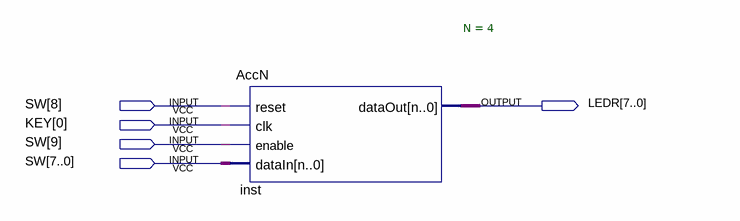
[diagram p0: schematic sheet]
// Quartus schematic AccN_Demo.bdf as structural Verilog: 1 symbols, 5 pins
module AccN_Demo (
  input  [9:0] SW,
  input  [0:0] KEY,
  output [7:0] LEDR
);

  AccN #(.N(4)) inst (.reset(SW[8]), .clk(KEY[0]), .enable(SW[9]), .dataIn(SW[7:0]), .dataOut(LEDR));
endmodule
